# Altium schematic sheet TRACTIAN_Low-Power-MCU.SchDoc
size A
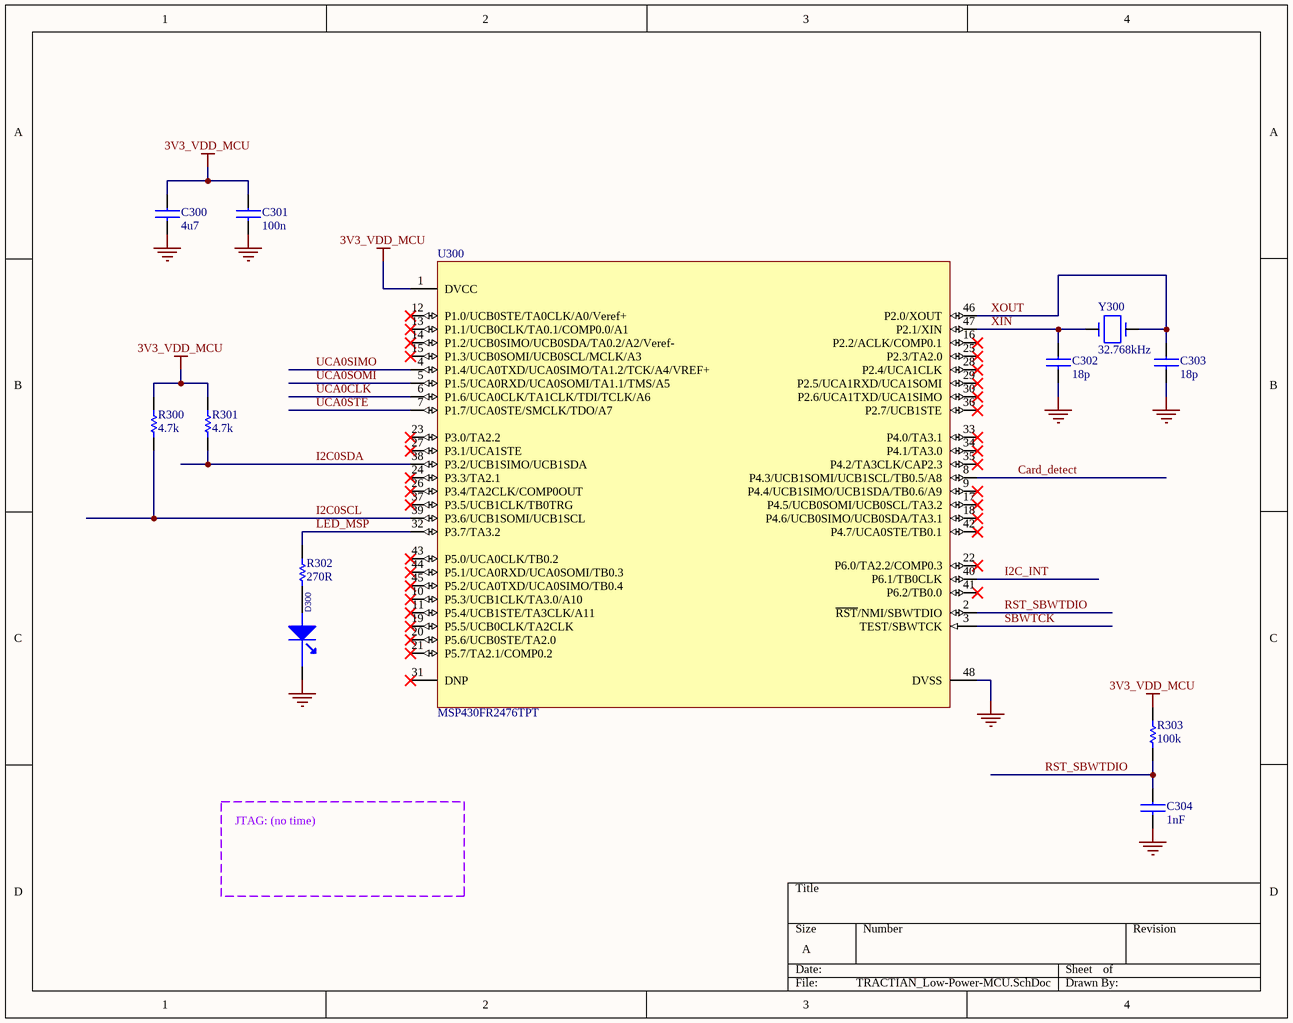
[diagram p0: TRACTIAN_Low-Power-MCU.SchDoc]

## Parts
C300  4u7  [C0402]
C301  100n  [C0402]
C302  18p  [C0402]
C303  18p  [C0402]
C304  1nF  [C0402]
D300  (no value)  [LED_0603]
R300  4.7k  [R0402]
R301  4.7k  [R0402]
R302  270R  [R0402]
R303  100k  [R0402]
U300  MSP430FR2476TPT  [LQFP-48]
Y300  32.768kHz  [ABS06]

## Nets
3V3_VDD_MCU: C300.1 C301.1 R300.2 R301.2 R303.2 U300.1(DVCC)
GND: C300.2 C301.2 C302.2 C303.2 C304.2 D300.1(cathode) U300.48(DVSS)
Card_detect: U300.8(P4.3/UCB1SOMI/UCB1SCL/TB0.5/A8)
I2C0SCL: R300.1 U300.39(P3.6/UCB1SOMI/UCB1SCL)
I2C0SDA: R301.1 U300.38(P3.2/UCB1SIMO/UCB1SDA)
I2C_INT: U300.40(P6.1/TB0CLK)
LED_MSP: R302.2 U300.32(P3.7/TA3.2)
RST_SBWTDIO: C304.1 R303.1 U300.2(~{RST}/NMI/SBWTDIO)
SBWTCK: U300.3(TEST/SBWTCK)
UCA0CLK: U300.6(P1.6/UCA0CLK/TA1CLK/TDI/TCLK/A6)
UCA0SIMO: U300.4(P1.4/UCA0TXD/UCA0SIMO/TA1.2/TCK/A4/VREF+)
UCA0SOMI: U300.5(P1.5/UCA0RXD/UCA0SOMI/TA1.1/TMS/A5)
UCA0STE: U300.7(P1.7/UCA0STE/SMCLK/TDO/A7)
XIN: C302.1 U300.47(P2.1/XIN) Y300.1
XOUT: C303.1 U300.46(P2.0/XOUT) Y300.2
NetD300_2: D300.2(ANODE) R302.1

Not connected (* = marked no-connect by the designer): U300 9(P4.4/UCB1SIMO/UCB1SDA/TB0.6/A9)* 10(P5.3/UCB1CLK/TA3.0/A10)* 11(P5.4/UCB1STE/TA3CLK/A11)* 12(P1.0/UCB0STE/TA0CLK/A0/Veref+)* 13(P1.1/UCB0CLK/TA0.1/COMP0.0/A1)* 14(P1.2/UCB0SIMO/UCB0SDA/TA0.2/A2/Veref-)* 15(P1.3/UCB0SOMI/UCB0SCL/MCLK/A3)* 16(P2.2/ACLK/COMP0.1)* 17(P4.5/UCB0SOMI/UCB0SCL/TA3.2)* 18(P4.6/UCB0SIMO/UCB0SDA/TA3.1)* 19(P5.5/UCB0CLK/TA2CLK)* 20(P5.6/UCB0STE/TA2.0)* 21(P5.7/TA2.1/COMP0.2)* 22(P6.0/TA2.2/COMP0.3)* 23(P3.0/TA2.2)* 24(P3.3/TA2.1)* 25(P2.3/TA2.0)* 26(P3.4/TA2CLK/COMP0OUT)* 27(P3.1/UCA1STE)* 28(P2.4/UCA1CLK)* 29(P2.5/UCA1RXD/UCA1SOMI)* 30(P2.6/UCA1TXD/UCA1SIMO)* 31(DNP)* 33(P4.0/TA3.1)* 34(P4.1/TA3.0)* 35(P4.2/TA3CLK/CAP2.3)* 36(P2.7/UCB1STE)* 37(P3.5/UCB1CLK/TB0TRG)* 41(P6.2/TB0.0)* 42(P4.7/UCA0STE/TB0.1)* 43(P5.0/UCA0CLK/TB0.2)* 44(P5.1/UCA0RXD/UCA0SOMI/TB0.3)* 45(P5.2/UCA0TXD/UCA0SIMO/TB0.4)*

## Notes on the sheet
- JTAG: (no time)

## Library data of the parts
C300 = C1005X5R1A475M: CAP CER 4.7UF 10V 20% X5R 0402; Manufacturer: TDK Corporation; Capacitance: 4.7µF; .Checked PCB: RF; Supplier 1: Digi-Key; Supplier Part Number 1: 445-8023-1-ND; Manufacturer Part Number: C1005X5R1A475M; RoHS: RoHS Compliant; Category: Capacitors; Stock 1: 10140; Pricing 1: 1=0.53, 10=0.415, 100=0.25, 250=0.18752, 500=0.16, 1000=0.125, 5000=0.095 (USD); Voltage - Rated: 10V; Tolerance: ±20%; Temperature Coefficient: X5R; Mounting Type: Surface Mount, MLCC; Operating Temperature: -55°C ~ 85°C; Applications: General Purpose; Ratings: -; Package / Case: 0402 (1005 Metric); Size / Dimension: 0.039" L x 0.020" W (1.00mm x 0.50mm); Height - Seated (Max): -; Thickness (Max): -; Lead Spacing: -; Features: -; Packaging: Cut Tape (CT); Lead Style: -; ComponentLink1URL: http://www.tdk.com/pdf/general_B11.pdf; ComponentLink1Description: http://www.tdk.com/pdf/general_B11.pdf; .Checked SCH: RF
C301 = C1005X5R1H104K: CAP CER .10UF 50V X5R 10% 0402; Manufacturer: TDK Corporation; Capacitance: 0.1µF; Value: 100nF; .Checked PCB: used; Category: Capacitors; Supplier Part Number: 445-5942-1-ND; Manufacturer Part Number: C1005X5R1H104K; Operating Temperature: -55°C ~ 85°C; Package / Case: 0402 (1005 Metric); Price 1k [$]: 0.02340; .Checked SCH: used; Voltage - Rated: 50V; Supplier: Digikey; Supplier 1: Digi-Key; Supplier Part Number 1: 445-5942-1-ND; RoHS: RoHS Compliant; Stock 1: 106926; Pricing 1: 1=0.27, 10=0.18, 100=0.072, 250=0.05176, 500=0.0369, 1000=0.027 (USD); Tolerance: ±10%; Temperature Coefficient: X5R; Mounting Type: Surface Mount, MLCC; Applications: General Purpose; Ratings: -; Size / Dimension: 0.039" L x 0.020" W (1.00mm x 0.50mm); Height - Seated (Max): -; Thickness (Max): 0.022" (0.55mm); Lead Spacing: -; Features: -; Packaging: Cut Tape (CT); Lead Style: -; ComponentLink1URL: http://www.tdk.co.jp/tefe02/e412_c.pdf; ComponentLink1Description: http://www.tdk.co.jp/tefe02/e412_c.pdf
C302 C303 = C1005C0G1H180J: CAP CER 18PF 50V C0G 5% 0402; Manufacturer: TDK Corporation; .Checked PCB: used; Temperature Coefficient: C0G, NP0; Capacitance: 18pF; Category: Capacitors; Supplier Part Number: 445-1238-1-ND; Manufacturer Part Number: C1005C0G1H180J; Operating Temperature: -55°C ~ 125°C; Package / Case: 0402 (1005 Metric); Price 1k [$]: 0.00468; Value: 18pF; .Checked SCH: used; Voltage - Rated: 50V; Supplier: Digikey; Supplier 1: Digi-Key; Supplier Part Number 1: 445-1238-1-ND; RoHS: RoHS Compliant; Stock 1: 24321; Pricing 1: 1=0.08, 10=0.05, 100=0.018, 250=0.013, 500=0.0096, 1000=0.0065 (USD); Tolerance: ±5%; Mounting Type: Surface Mount, MLCC; Applications: General Purpose; Ratings: -; Size / Dimension: 0.039" L x 0.020" W (1.00mm x 0.50mm); Height - Seated (Max): -; Thickness (Max): 0.022" (0.55mm); Lead Spacing: -; Features: -; Packaging: Cut Tape (CT); Lead Style: -; ComponentLink1URL: http://www.tdk.co.jp/tefe02/e412_c.pdf; ComponentLink1Description: http://www.tdk.co.jp/tefe02/e412_c.pdf
C304 = Cap: CAPACITOR; ComponentLink1URL: http://www.vishay.com/doc?34104; ComponentLink1Description: http://www.vishay.com/doc?34104; Value: 1nF
D300 = LED: Generic LED 0603
R300-R302 = Res: Generic resistor
  R300 R301: Value: 4.7k
  R302: Value: 270R
R303 = RMCF0402FT100K: RES 100K OHM 1/16W 1% 0402 SMD; Manufacturer: Stackpole Electronics Inc; Power (Watts): 0.063W, 1/16W; .Checked PCB: used; Temperature Coefficient: ±100ppm/°C; Category: Resistors; Supplier Part Number: RMCF0402FT100KCT-ND; Manufacturer Part Number: RMCF0402FT100K; Package / Case: 0402 (1005 Metric); Price 1k [$]: 0.00384; Resistance (Ohms): 100K; Tolerance: ±1%; Value: 100k; .Checked SCH: used; Supplier: Digikey; Supplier 1: Digi-Key; Supplier Part Number 1: RMCF0402FT100KCT-ND; RoHS: RoHS Compliant; Stock 1: 95; Pricing 1: 1=0.04, 10=0.025, 50=0.0138, 100=0.0105, 250=0.0078, 500=0.00576, 1000=0.00384 (USD); Composition: Thick Film; Features: -; Size / Dimension: 0.039" L x 0.020" W (1.00mm x 0.50mm); Height: 0.016" (0.40mm); Number of Terminations: 2; Packaging: Cut Tape (CT); ComponentLink1URL: http://www.seielect.com/Catalog/SEI-RMCF.pdf; ComponentLink1Description: http://www.seielect.com/Catalog/SEI-RMCF.pdf
U300 = MSP430FR2476TPT: MCU 16-BIT ULTRA-LOW-POWER MSP430FR2476TPT LQFP-48; Mouser PN: 595-MSP430FR2476TPT; Digikey PN: 296-MSP430FR2476TPTTR-ND; PN: MSP430FR2476TPT; Manufacturer Name: *
Y300 = ABS06-32.768KHZ-9-1-T: CRYSTAL 32.768 KHZ 9.0 PF SMD; Manufacturer: Abracon Corporation; .Checked PCB: used; Frequency Stability: ±10ppm; Load Capacitance: 9pF; Operating Mode: Fundamental; .Checked SCH: used; Category: Crystals and Oscillators; Supplier Part Number: 535-10247-1-ND; Manufacturer Part Number: ABS06-32.768KHZ-9-1-T; Operating Temperature: -40°C ~ 85°C; Package / Case: 2-SMD, No Lead (DFN, LCC); Price 1k [$]: 1.24500; Value: 32.768kHz; Frequency: 32.768kHz; Supplier: Digikey; Supplier 1: Digi-Key; Supplier Part Number 1: 535-10247-1-ND; RoHS: RoHS Compliant; Stock 1: 5693; Pricing 1: 1=2.81, 10=2.438, 50=2.1376, 100=1.6875, 500=1.425 (USD); Type: kHz Crystal (Tuning Fork); Frequency Tolerance: ±10ppm; Mounting Type: Surface Mount; Size / Dimension: 0.079" L x 0.047" W (2.00mm x 1.20mm); Height: 0.024" (0.60mm); Packaging: Cut Tape (CT); ComponentLink1URL: http://www.abracon.com/Resonators/ABS06.pdf; ComponentLink1Description: http://www.abracon.com/Resonators/ABS06.pdf